# Altium schematic sheet USB_OTG_FS.SchDoc: USB_OTG_FS
size A4; DocumentNumber: MB1246; Revision: B.1; SheetNumber: 9; SheetTotal: 17; Project: STM32H7xxI-EVAL
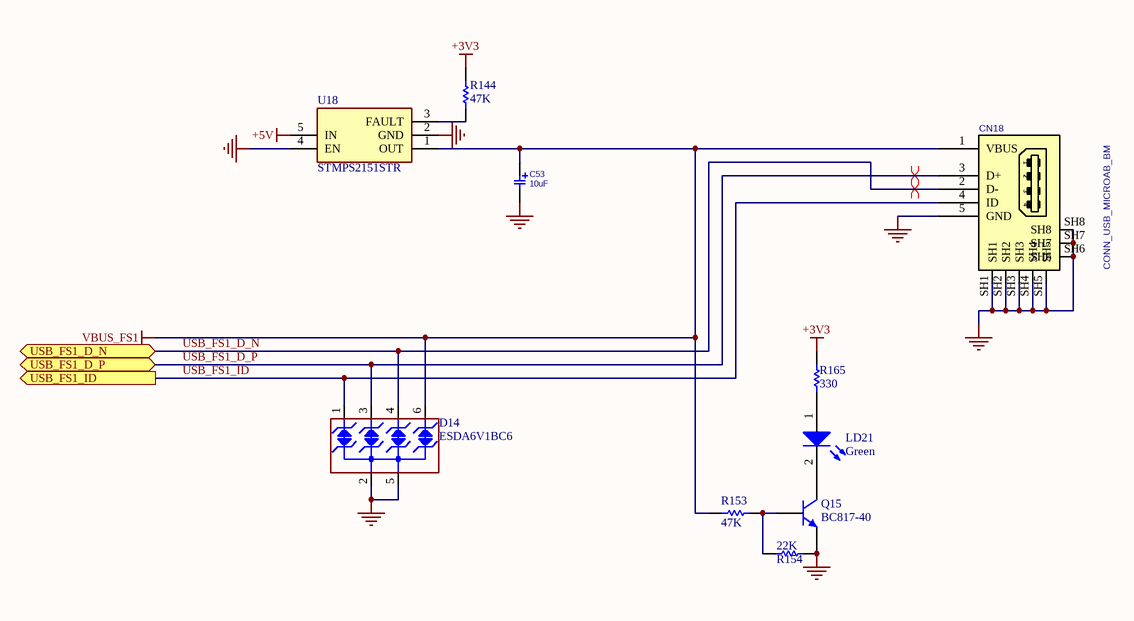
[diagram p0: USB_OTG_FS.SchDoc]

## Parts
C53  10uF  [C_TN_3216]
CN18  CONN_USB_MICROAB_BM  [USB_MICRO_AB_BM_SHT]
D14  ESDA6V1BC6  [SOT95P280X145-6N]
LD21  Green  [LED0603GRN]
Q15  BC817-40  [SOT-23-3]
R144  47K  [R0603E]
R153  47K  [R0603E]
R154  22K  [R0603E]
R165  330  [R0603E]
U18  STMPS2151STR  [SOT95P280X145-5N]

## Ports
USB_FS1_D_N (bidir), USB_FS1_D_P (bidir), USB_FS1_ID (out)

## Nets
+3V3: R144.1 R165.2
+5V: U18.5(IN)
GND: C53.2 CN18.5(GND) CN18.SH1 CN18.SH2 CN18.SH3 CN18.SH4 CN18.SH5 CN18.SH6 CN18.SH7 CN18.SH8 D14.2(IO2) D14.5(IO4) Q15.2(E) R154.1 U18.2(GND) U18.4(EN)
VBUS_FS1: C53.1 CN18.1(VBUS) D14.6(NC) R153.1 U18.1(OUT)
USB_FS1_D_N: CN18.2(D-) D14.4(IO3) ; port USB_FS1_D_N
USB_FS1_D_P: CN18.3(D+) D14.3(GND) ; port USB_FS1_D_P
USB_FS1_ID: CN18.4(ID) D14.1(IO1) ; port USB_FS1_ID
NetLD21_1: LD21.1(A) R165.1
NetLD21_2: LD21.2(K) Q15.3(C)
NetQ15_1: Q15.1(B) R153.2 R154.2
NetR144_2: R144.2 U18.3(FAULT)

## Layout directives
differential pair: USB_FS1_D_N, USB_FS1_D_P

## Notes on the sheet
- Title:
- Project:
- Size:
- Date:
- A4
- Reference:
- Sheet:
- Revision:
- of

## Library data of the parts
C53 = CAP_SMD_TAN_10uF_6.3V: CAP, SMD, TAN; PARAM: 20%, 300mOhm, -55~105oC; MANF: VISHAY; MANF_P#: T55A106M6R3C0300; PARAM2: 6.3V; PRICE: 0.46$; VALUE: 10uF
CN18 = CONN_USB_MICRO_AB_BM_SHT: CONN, USB, MICRO AB, R/A, SMD, BOTTOM MOUNT; MANF_P#: 47589-0001; MANF: MOLEX; PARAM2: 30VAC; PARAM: 1.8A, -20~85oC; MANF_P#2: HIROSE ZX62D-AB-5P8; PRICE: 0.75$; VALUE: CONN_USB_MICROAB_BM
D14 = ESDA6V1BC6: 4-line ESD protection; Manuf_1: STM; Manuf_Part_1: ESDA5V3L; Ref St: 9179034; Provided: ST; ECCN_US/EU: EAR99/NEC; Distrib: ST; Order: ESDA5V3L; Ordered by: STM
LD21 = LED2: Typical RED, GREEN, YELLOW, AMBER GaAs LED; Published: 8-Jun-2000; Revision: July-2002: Re-released for DXP Platform.; Publisher: Altium Limited
Q15 = BC817-40: TRANS NPN 300V 0.3A SOT23; Manufacturer: Micro Commercial Co; Manufacturer Part Number: MMBTA42-TP; Current Footprint: TO-236-3, SC-59, SOT-23-3; PCB Name: GS-101; Board Qty: 1000; ITEM/NO: 71; Vce Saturation (Max) @ Ib, Ic: 500mV @ 2mA, 20mA; DC Current Gain (hFE) (Min) @ Ic, Vce: 40 @ 30mA, 10V; Frequency - Transition: 50MHz; Current - Collector Cutoff (Max): 100nA (ICBO); HelpURL: D:\HNA\Datasheet Documents\MMBTA42(SOT-23).pdf; Part Number: BC817-40; Size / Dimension: NULL; Supplier: Digi-Key; Mounting Type: Surface Mount; Base Part Number: MMBTA42; Supplier Device Package: SOT-23; Part Status: Active; RoHS: RoHS Compliant; Category: Discrete Semiconductor Products; Supplier Part Number: MMBTA42TPMSCT-ND; Operating Temperature: -55°C ~ 150°C (TJ); Package / Case: TO-236-3, SC-59, SOT-23-3; Transistor Type: NPN; Packaging: Cut Tape (CT); Pricing: 1=0.22, 10=0.203, 25=0.146, 100=0.1136, 250=0.07136, 500=0.06084, 1000=0.04137 (USD); Stock: 49544
R144 R153 R154 R165 = res1: Resistor; Value: 1K; Published: 8-Jun-2000; Revision: July-2002: Re-released for DXP Platform.; Publisher: Altium Limited
U18 = STMPS2151STR: Integrated Circuit; Manufacturer_Name: ST; Datasheet Link: https://www.st.com/resource/en/datasheet/stmps2141.pdf; Height: 1.45mm; Manufacturer_Part_Number: STMPS2151STR